# Altium project TPS5450-TEST.PrjPcb
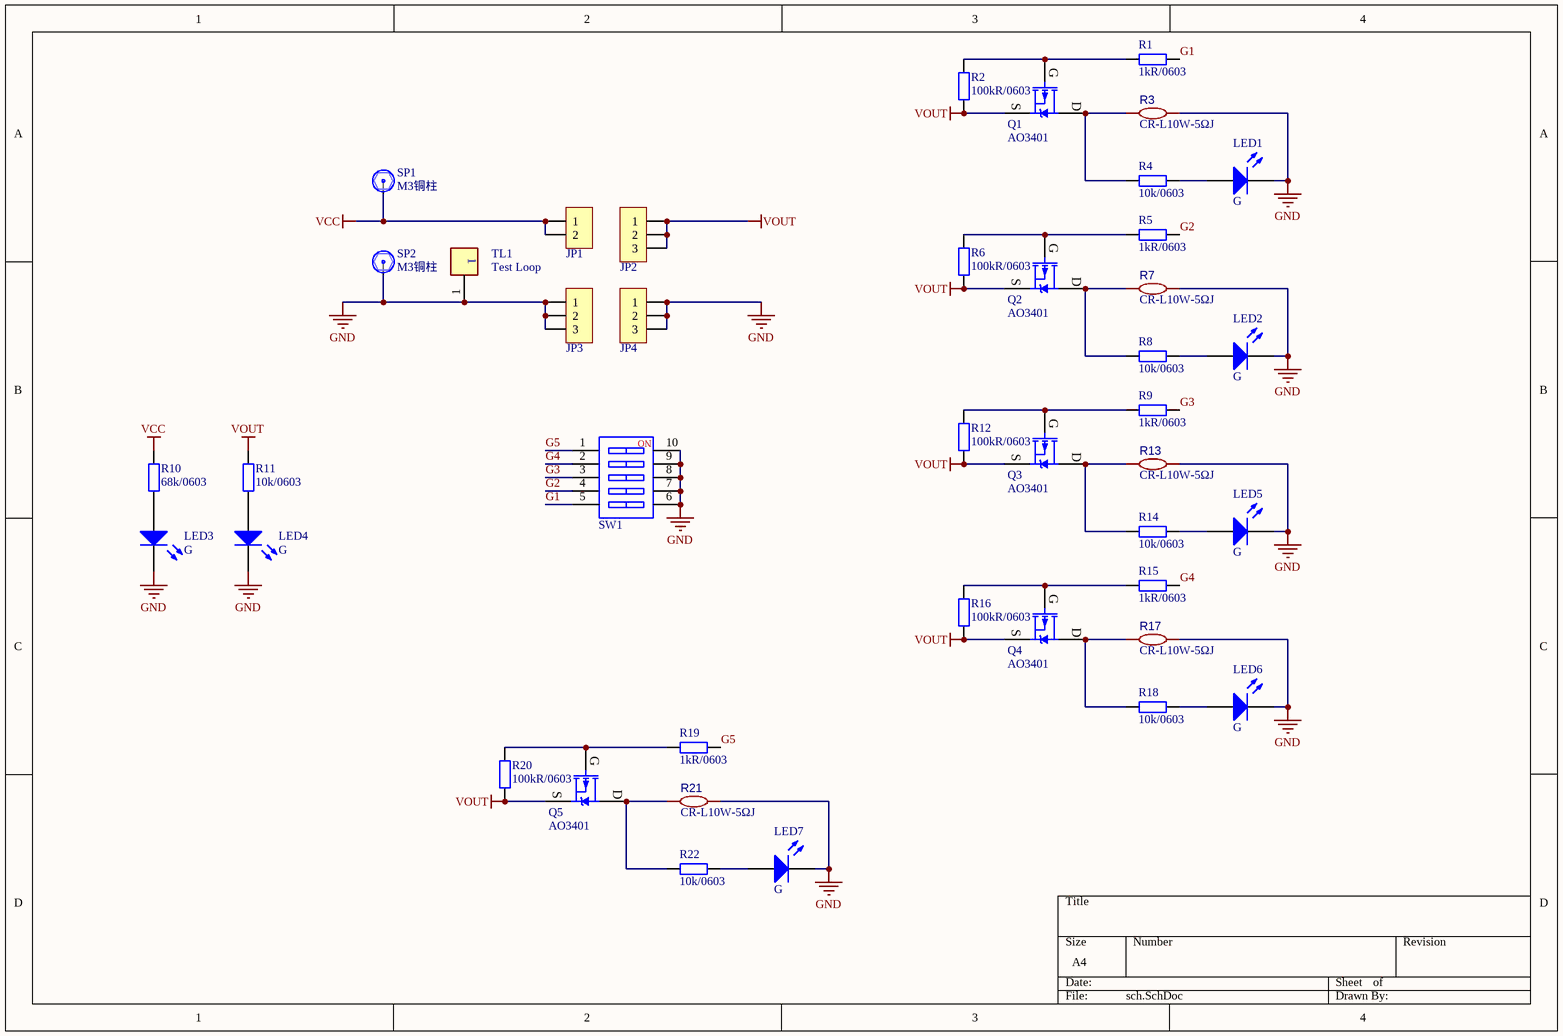
[diagram p0: sch.SchDoc]
1 sheet, 42 parts. Net scope: global (net labels, ports and power ports of the same name join across sheets).
Board file: pcb.PcbDoc

## Sheet sch.SchDoc
size A4; SheetNumber: 1; SheetTotal: 1

### Parts
JP1  HDR-1X2  [HDR2.54-M-LI-2P]  (value not drawn)
JP2  HDR-1X3  [HDR2.54-M-LI-3P]  (value not drawn)
JP3  HDR-1X3  [HDR2.54-M-LI-3P]  (value not drawn)
JP4  HDR-1X3  [HDR2.54-M-LI-3P]  (value not drawn)
LED1  G  [LED0603_B]
LED2  G  [LED0603_B]
LED3  G  [LED0603_B]
LED4  G  [LED0603_B]
LED5  G  [LED0603_B]
LED6  G  [LED0603_B]
LED7  G  [LED0603_B]
Q1  AO3401  [SOT23-3N]
Q2  AO3401  [SOT23-3N]
Q3  AO3401  [SOT23-3N]
Q4  AO3401  [SOT23-3N]
Q5  AO3401  [SOT23-3N]
R1  1kR/0603  [R0603_M]
R2  100kR/0603  [R0603_M]
R3  CR-L10W-5ΩJ  [RES-TH_BD9.5-L48.0-P52.00-D0.7]
R4  10k/0603  [R0603_M]
R5  1kR/0603  [R0603_M]
R6  100kR/0603  [R0603_M]
R7  CR-L10W-5ΩJ  [RES-TH_BD9.5-L48.0-P52.00-D0.7]
R8  10k/0603  [R0603_M]
R9  1kR/0603  [R0603_M]
R10  68k/0603  [R0603_M]
R11  10k/0603  [R0603_M]
R12  100kR/0603  [R0603_M]
R13  CR-L10W-5ΩJ  [RES-TH_BD9.5-L48.0-P52.00-D0.7]
R14  10k/0603  [R0603_M]
R15  1kR/0603  [R0603_M]
R16  100kR/0603  [R0603_M]
R17  CR-L10W-5ΩJ  [RES-TH_BD9.5-L48.0-P52.00-D0.7]
R18  10k/0603  [R0603_M]
R19  1kR/0603  [R0603_M]
R20  100kR/0603  [R0603_M]
R21  CR-L10W-5ΩJ  [RES-TH_BD9.5-L48.0-P52.00-D0.7]
R22  10k/0603  [R0603_M]
SP1  M3铜柱  [M3x4_N]
SP2  M3铜柱  [M3x4_N]
SW1  DIP-SW-5P  [SW DIP-5P]  (value not drawn)
TL1  Test Loop  [FP-5002-MFG]

### Nets
GND: JP3.1 JP3.2 JP3.3 JP4.1 JP4.2 JP4.3 LED1.2(K) LED2.2(K) LED3.2(K) LED4.2(K) LED5.2(K) LED6.2(K) LED7.2(K) R3.2 R7.2 R13.2 R17.2 R21.2 SP2.1 SW1.6 SW1.7 SW1.8 SW1.9 SW1.10 TL1.1
VCC: JP1.1 JP1.2 R10.1 SP1.1
VOUT: JP2.1 JP2.2 JP2.3 Q1.2(S) Q2.2(S) Q3.2(S) Q4.2(S) Q5.2(S) R2.1 R6.1 R11.1 R12.1 R16.1 R20.1
G1: R1.1 SW1.5
G2: R5.1 SW1.4
G3: R9.1 SW1.3
G4: R15.1 SW1.2
G5: R19.1 SW1.1
NetLED1_1: LED1.1(A) R4.2
NetLED2_1: LED2.1(A) R8.2
NetLED3_1: LED3.1(A) R10.2
NetLED4_1: LED4.1(A) R11.2
NetLED5_1: LED5.1(A) R14.2
NetLED6_1: LED6.1(A) R18.2
NetLED7_1: LED7.1(A) R22.2
NetQ1_1: Q1.1(G) R1.2 R2.2
NetQ1_3: Q1.3(D) R3.1 R4.1
NetQ2_1: Q2.1(G) R5.2 R6.2
NetQ2_3: Q2.3(D) R7.1 R8.1
NetQ3_1: Q3.1(G) R9.2 R12.2
NetQ3_3: Q3.3(D) R13.1 R14.1
NetQ4_1: Q4.1(G) R15.2 R16.2
NetQ4_3: Q4.3(D) R17.1 R18.1
NetQ5_1: Q5.1(G) R19.2 R20.2
NetQ5_3: Q5.3(D) R21.1 R22.1

### Notes on the sheet
- (in symbol DIP-SW-5P) NO

### Library data of the parts
JP1 = Header 2: 2P接插件; 联系卖家，免费查找封装: 唯一出售店铺网址https://shop463601444.taobao.com; 封装库来自淘宝卖家ID：黄晶宝石: 其他店铺购入均为盗版封装库，请立即申请退款，本店现金奖励50~200元; BOM名称: 2P接插件
JP2-JP4 = Header 3: 3P接插件; 联系卖家，免费查找封装: 唯一出售店铺网址https://shop463601444.taobao.com; 封装库来自淘宝卖家ID：黄晶宝石: 其他店铺购入均为盗版封装库，请立即申请退款，本店现金奖励50~200元; BOM名称: 3P接插件
LED1-LED7 = LED: 贴片LED; 封装库来自淘宝卖家：黄晶宝石: 其他店铺购入均为盗版封装库，无更新权益，请立即申请退款，本店现金奖励200~1000元; BOM名称: 贴片LED
Q1-Q5 = AO3401: P沟道 30V/4.2A; BOM名称: 场效应管; 联系下单店铺卖家 免费帮你查找封装: 联系下单店铺卖家 免费技术支持; 当前库版本V2025.1.5，下一版本发布时间2025年2月份 @淘宝卖家:黄晶宝石: 最新版本发布网址https://item.taobao.com/item.htm?id=566775463719; 参数: P沟道 30V/4.2A
R1 R2 R4-R6 R8-R12 R14-R16 R18-R20 R22 = R: 贴片电阻; 联系下单店铺卖家 免费帮你查找封装: 联系下单店铺卖家 免费技术指导; BOM名称: 贴片电阻
R3 R7 R13 R17 R21 = CR-L10W-10ΩJ: Symbol: CR-L10W-10ΩJ
SP1 SP2 = 铜柱大焊盘: 铜柱; 联系下单店铺卖家 免费技术支持: 联系下单店铺卖家 免费帮你查找封装; BOM名称: 铜柱
SW1 = DIP-SW-5P: 5路拨码开关; 联系下单店铺卖家 免费技术支持: 联系下单店铺卖家 免费帮你查找封装; BOM名称: 5路拨码开关
TL1 = CMP-2000-05182-2: PC TEST POINT MINIATURE WHITE; Body Material: Bronze; Insulation: Insulated; Inside Diameter: 1.27mm; Number of Ports: 1; Outside Diameter: 2.54mm; Hole Diameter: 1.6mm; Plating: Silver; Contact Plating: Silver; Orientation: Straight; REACH SVHC: No SVHC; Series: THM; Packaging: Bulk; Material: Nylon; Flammability Rating: UL94 V-0; Mount: Through Hole; Color: White; Housing Color: White; Length: 7.62mm; Contact Material: Bronze; Lead Free: Lead Free; Package Quantity: 100; RoHS Compliant: Yes